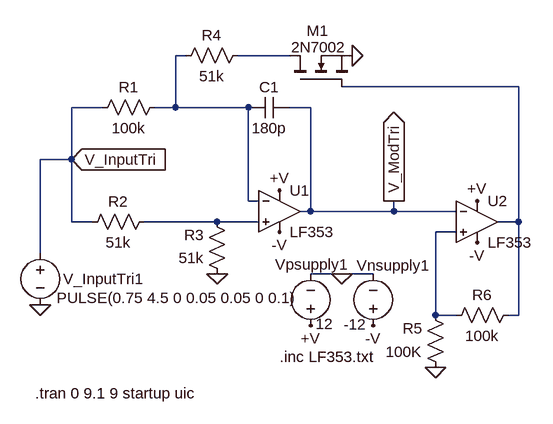
[diagram p0: schematic VCO_only.asc]
VCO_only.asc, the LTspice schematic file:
Version 4
SHEET 1 880 944
WIRE -400 272 -416 272
WIRE -240 272 -320 272
WIRE 112 320 -160 320
WIRE -528 352 -576 352
WIRE -416 352 -416 272
WIRE -416 352 -448 352
WIRE -304 352 -416 352
WIRE -208 352 -240 352
WIRE -576 432 -576 352
WIRE -576 432 -624 432
WIRE -304 496 -304 352
WIRE -288 496 -304 496
WIRE -208 512 -208 352
WIRE -208 512 -224 512
WIRE -80 512 -80 496
WIRE -80 512 -208 512
WIRE 16 512 -80 512
WIRE -576 528 -576 432
WIRE -544 528 -576 528
WIRE -352 528 -464 528
WIRE -288 528 -352 528
WIRE 112 528 112 320
WIRE 112 528 80 528
WIRE 16 544 -16 544
WIRE -624 576 -624 432
WIRE -160 608 -208 608
WIRE -112 608 -160 608
WIRE -16 672 -16 544
WIRE 16 672 -16 672
WIRE 112 672 112 528
WIRE 112 672 96 672
FLAG -160 608 0
FLAG -208 688 +V
FLAG -112 688 -V
FLAG -352 608 0
FLAG -16 752 0
FLAG -624 656 0
FLAG -256 480 +V
FLAG 48 496 +V
FLAG -256 544 -V
FLAG 48 560 -V
FLAG -80 496 V_ModTri
IOPIN -80 496 Out
FLAG -576 432 V_InputTri
IOPIN -576 432 In
FLAG -144 272 0
SYMBOL voltage -112 704 M180
WINDOW 0 -25 109 Left 2
WINDOW 3 -45 18 Left 2
WINDOW 123 0 0 Left 2
WINDOW 39 0 0 Left 2
SYMATTR InstName Vnsupply1
SYMATTR Value -12
SYMBOL voltage -208 704 R180
WINDOW 0 -58 110 Left 2
WINDOW 3 -35 19 Left 2
WINDOW 123 0 0 Left 2
WINDOW 39 0 0 Left 2
SYMATTR InstName Vpsupply1
SYMATTR Value 12
SYMBOL res -432 336 R90
WINDOW 0 0 56 VBottom 2
WINDOW 3 32 56 VTop 2
SYMATTR InstName R1
SYMATTR Value 100k
SYMBOL cap -240 336 R90
WINDOW 0 0 32 VBottom 2
WINDOW 3 32 32 VTop 2
SYMATTR InstName C1
SYMATTR Value 180p
SYMBOL res -448 512 R90
WINDOW 0 0 56 VBottom 2
WINDOW 3 32 56 VTop 2
SYMATTR InstName R2
SYMATTR Value 51k
SYMBOL res -336 624 R180
WINDOW 0 36 76 Left 2
WINDOW 3 36 40 Left 2
SYMATTR InstName R3
SYMATTR Value 51k
SYMBOL res 112 656 R90
WINDOW 0 0 56 VBottom 2
WINDOW 3 32 56 VTop 2
SYMATTR InstName R6
SYMATTR Value 100k
SYMBOL res 0 768 R180
WINDOW 0 36 76 Left 2
WINDOW 3 36 40 Left 2
SYMATTR InstName R5
SYMATTR Value 100K
SYMBOL voltage -624 560 R0
WINDOW 123 0 0 Left 2
WINDOW 39 0 0 Left 2
WINDOW 0 35 56 Left 2
WINDOW 3 25 85 Left 2
SYMATTR InstName V_InputTri1
SYMATTR Value PULSE(0.75 4.5 0 0.05 0.05 0 0.1)
SYMBOL Opamps\\opamp2 -256 448 R0
SYMATTR InstName U1
SYMATTR Value LF353
SYMBOL Opamps\\opamp2 48 464 R0
SYMATTR InstName U2
SYMATTR Value LF353
SYMBOL nmos -240 320 R270
WINDOW 0 86 26 VRight 2
WINDOW 3 61 2 VRight 2
SYMATTR InstName M1
SYMATTR Value 2N7002
SYMBOL res -304 256 R90
WINDOW 0 0 56 VBottom 2
WINDOW 3 32 56 VTop 2
SYMATTR InstName R4
SYMATTR Value 51k
TEXT -256 736 Left 2 !.inc LF353.txt
TEXT -632 792 Left 2 !.tran 0 9.1 9 startup uic

The netlist it stands for:
* VCO_only.asc
Vnsupply1 -V 0 -12
Vpsupply1 +V 0 12
R1 N001 V_InputTri 100k
C1 V_ModTri N001 180p
R2 N004 V_InputTri 51k
R3 0 N004 51k
R6 N003 N005 100k
R5 0 N005 100K
V_InputTri1 V_InputTri 0 PULSE(0.75 4.5 0 0.05 0.05 0 0.1)
XU1 N004 N001 +V -V V_ModTri LF353  ; pins In+ In- V+ V- OUT
XU2 N005 V_ModTri +V -V N003 LF353  ; pins In+ In- V+ V- OUT
M1 N002 N003 0 0 2N7002
R4 N002 N001 51k
.model NMOS NMOS
.model PMOS PMOS
.lib standard.mos
.inc LF353.txt
.tran 0 9.1 9 startup uic
.backanno
.end